# Altium schematic sheet WatchDog.SchDoc
size 420 x 297 mm; SheetNumber: 12; SheetTotal: 15
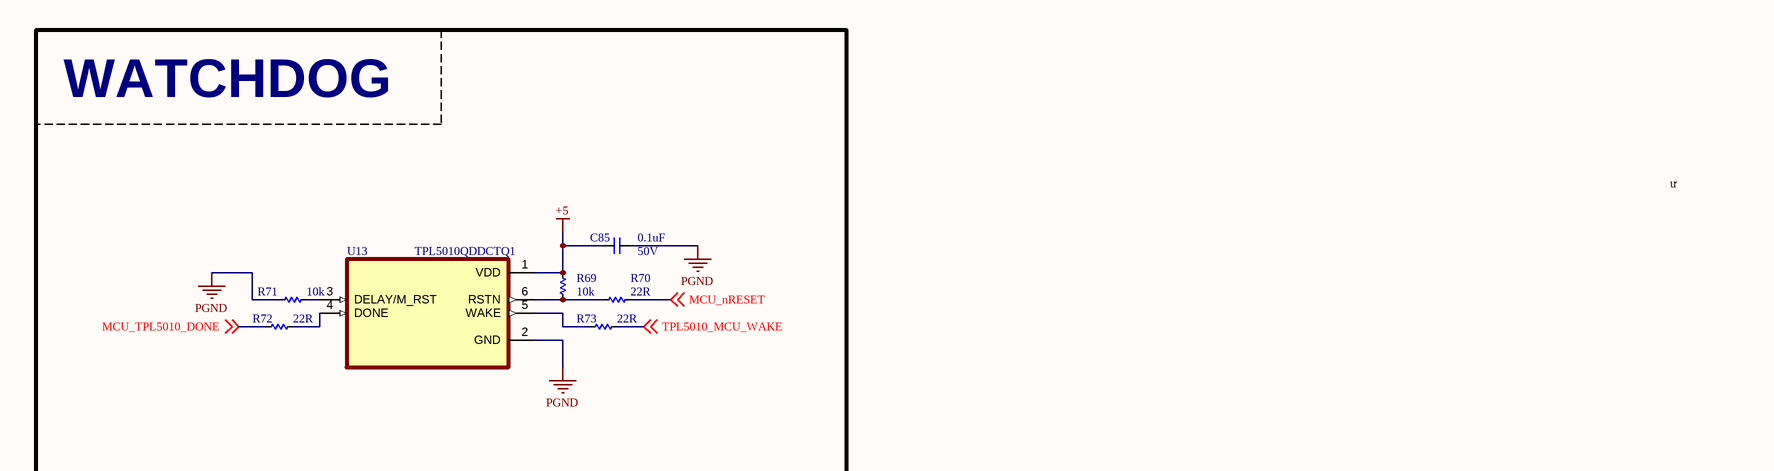
[diagram p0: WatchDog.SchDoc, left]

## Parts
C85  0.1uF  Voltage: 50V  [CAP_C_1608X80]
R69  10k  [RES_C_1608X60]
R70  22R  [RES_C_1608X60]
R71  10k  [RES_C_1608X60]
R72  22R  [RES_C_1608X60]
R73  22R  [RES_C_1608X60]
U13  TPL5010QDDCTQ1  [SOT-23-THN-6]

## Blocks framed on the sheet
WATCHDOG: C85 R69-R73 U13

## Nets
+5: C85.2 R69.2 U13.1(VDD)
PGND: C85.1 R71.1 U13.2(GND)
MCU_nRESET: R70.1 ; off-sheet MCU_nRESET
MCU_TPL5010_DONE: R72.2 ; off-sheet MCU_TPL5010_DONE
TPL5010_MCU_WAKE: R73.1 ; off-sheet TPL5010_MCU_WAKE
NetR69_1: R69.1 R70.2 U13.6(RSTN)
NetR71_2: R71.2 U13.3(DELAY/M_RST)
NetR72_1: R72.1 U13.4(DONE)
NetR73_2: R73.2 U13.5(WAKE)

## Notes on the sheet
- ư
- Project:
- DAL_PDU
- Sub-system:
- IGRVT-50
- Design by:
- KIEN HOANG
- BAO BUI
- Sheet title:
- Sheet
- A3
- of
- Checked by:
- Approved by:
- VU PHAM
- Revision:
- Document No:
- Size:
- Date:

## Library data of the parts
C85 = _CAP_C_2: CAP
R69-R73 = _RES_B_2_2: RES